# Altium schematic sheet VoltageRegulator1.SchDoc: VOLTAGE REGULATOR
size A4; DrawnBy: ROOPA GHATKE; SheetNumber: 1; SheetTotal: 1
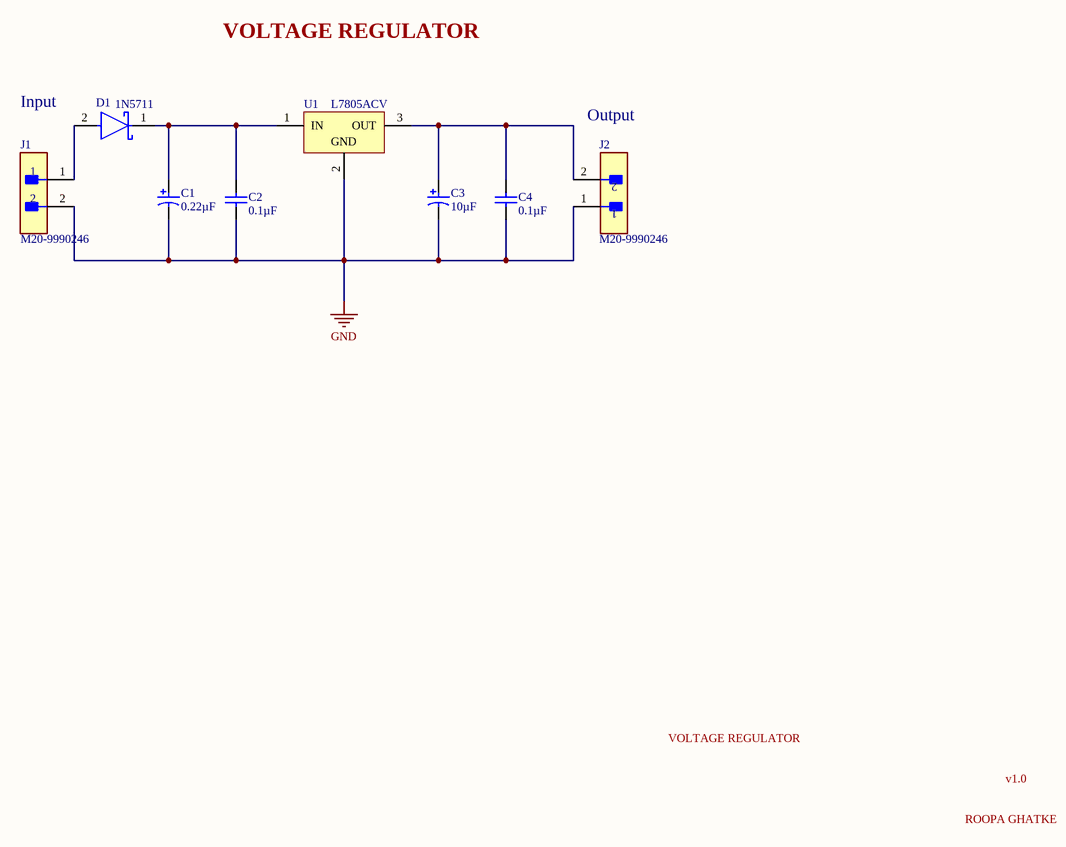
[diagram p0: VoltageRegulator1.SchDoc]

## Parts
C1  0.22µF  [CAPPR55-200-1100X500X1200]
C2  0.1µF  [CAPR51-254-508X318X736]
C3  10µF  [CAPPR55-200-1100X500X1200]
C4  0.1µF  [CAPR51-254-508X318X736]
D1  1N5711  [FP-DO-35-MFG]
J1  M20-9990246  [FP-M20-9990246-MFG]
J2  M20-9990246  [FP-M20-9990246-MFG]
U1  L7805ACV  [TO220]

## Nets
GND: C1.2 C2.2 C3.2 C4.1 J1.2 J2.1 U1.2(GND)
NetC1_1: C1.1 C2.1 D1.1(C) U1.1(IN)
NetC3_1: C3.1 C4.2 J2.2 U1.3(OUT)
NetD1_2: D1.2(A) J1.1

## Notes on the sheet
- VOLTAGE REGULATOR
- (near D1) Input
- Output
- v1.0
- ROOPA GHATKE

## Library data of the parts
C1 = CMP-1665-00040-2: Aluminum Electrolytic Capacitor, 2.2 uF, +/- 20%, 50 V, -40 to 85 degC, 2-Pin THD, RoHS, Bulk; Manufacturer: Panasonic; Voltage: 50V; Dielectric Material: Aluminium; Ripple Current: 20mA; Leakage Current: 3uA; Life (Hours): 2000Hour; Lead/Base Style: Straight; Dissipation Factor: 0.12%; Lead Diameter: 0.5mm; Capacitance: 2.2uF; Number of Pins: 2; Manufacturer URL: http://www.panasonic.com/; Contact Plating: Tin; Datasheet Version: Rev. 05, 10/2016; RoHSCompliant: true; Height - Seated (Max): 0.472inch; Height: 11mm; Length: 11mm; Termination: Radial; Packaging: Bulk; Case/Package: Radial; Voltage Rating (DC): 50V; Package Quantity: 200; Datasheet URL: https://industrial.panasonic.com/cdbs/www-data/pdf/RDF0000/ABA0000C1218.pdf; Radiation Hardening: No; REACH SVHC: NoSVHC; Max Operating Temperature: 85degC; Voltage Rating: 50V; Mount: ThroughHole; Diameter: 5mm; Lead Pitch: 2mm; Tolerance: 20%; Package Reference: CAPPR55-200-1100X500X1200; Lead Free: LeadFree; Package Description: 2-Pin Radial Lead, Dia 5 mm, Height 12 mm; Min Operating Temperature: -40degC
C2 C4 = CMP-1664-00004-1: Radial Leaded Multilayer Ceramic Capacitor, 0.1 uF, +/- 10%, 50 V, -55 to 125 degC, 2-Pin THD, RoHS, Tape and Reel; Case\Package: SOT-23-5; Max Power Dissipation: 250 mW; Output Current: 150 mA; Dropout Voltage: 260 mV; Outputs: 1; Output Voltage: 5 V; Max Input Voltage: 8 V; Min Operating Temperature: -40 degC; Packaging: Tape and Reel; Height: 1.3 mm; Radiation Hardening: No; Pins: 5; ComponentLink1Description: Manufacturer URL; Mount: Surface Mount; RoHSCompliant: true; Max Operating Temperature: 85 degC; PackageReference: CAPR51-254-508X318X736; ComponentLink2URL: http://www.kemet.com/docfinder?Partnumber=C320C104K5R5TA; PackageDescription: 2-Pin Through Hole Device, Body 5.08 x 3.18 mm, Pitch 2.54 mm; ComponentLink1URL: http://www.kemet.com/; Width: 1.8 mm; Package Quantity: 3000; DatasheetVersion: Dec-15; Length: 3 mm; ComponentLink2Description: Datasheet
C3 = CMP-1665-00036-2: Aluminum Electrolytic Capacitor, 22 uF, +/- 20%, 50 V, -40 to 85 degC, 2-Pin THD, RoHS, Bulk; Manufacturer: Panasonic; Ripple Current: 100mA; Life (Hours): 2000Hour; Voltage: 50V; Dissipation Factor: 0.12%; Leakage Current: 3uA; Lead/Base Style: Straight; Capacitance: 22uF; Lead Diameter: 0.5mm; Max Operating Temperature: 85degC; Height: 11mm; Package Reference: CAPPR55-200-1100X500X1200; Radiation Hardening: No; RoHSCompliant: true; Termination: Radial; Case/Package: Radial; REACH SVHC: NoSVHC; Height - Seated (Max): 0.472inch; Min Operating Temperature: -40degC; Packaging: Bulk; Manufacturer URL: http://www.panasonic.com/; Length: 11mm; Tolerance: 20%; Voltage Rating: 50V; Voltage Rating (DC): 50V; Datasheet URL: https://industrial.panasonic.com/cdbs/www-data/pdf/RDF0000/ABA0000C1218.pdf; Lead Pitch: 2mm; Ripple Current (AC): 100mA; Package Description: 2-Pin Radial Lead, Dia 5 mm, Height 12 mm; Diameter: 5mm; Datasheet Version: Rev. 05, 10/2016; Package Quantity: 200; Mount: ThroughHole
D1 = CMP-2000-05519-2: RF DIODE SCHOTTKY 70V 430MW DO35; Manufacturer: STMicroelectronics; Capacitance: 2pF; Max Junction Temp: +200°C; Value: 2pF; Forward Current: 15mA; ComponentLink2URL: https://www.st.com/resource/en/datasheet/1n5711.pdf; Reverse Voltage: 70V; Max Repetitive Reverse Voltage: 70V; Temperature Range Low: -65°C; Manufacturer Part Number: 1N5711; ComponentLink2Description: Datasheet; Automotive: No; Device Class L3: Schottky Diodes; Temperature Range High: +200°C; Ipc Land Pattern Name: DIOPA762W75L450D200; Octopart: https://octopart.com/1n5711-stmicroelectronics-55399277; Category: Diode; Height: 2mm; RoHS: TRUE; Package: DO-35; Lead Free: Yes; Digikey Description: RF DIODE SCHOTTKY 70V 430MW DO35; Mouser Description: Schottky Diodes & Rectifiers 15mA 70 Volt; Device Class L1: Discrete Semiconductors; Temperature: -65°C to +200°C; Device Class L2: Diodes
J1 J2 = CMP-15831-000009-1: CONN HEADER VERT 2POS 2.54MM; Manufacturer: Harwin; Conn Gender: Male; Conn Orientation: Vertical; Number Of Contacts: 2; Current Rating: 3A; ComponentLink2URL: https://cdn.harwin.com/pdfs/M20-999.pdf; ComponentLink2Description: Datasheet; Package: M20-9990246; Temperature: -40°C to +105°C; Octopart: https://octopart.com/m20-9990246-harwin-2590635; Mouser Description: 2.54mm (0.1") Pitch SIL Vertical PC Tail Pin Header, 6.1mm mating pin height, tin, 2 contacts; Temperature Range High: +105°C; Device Class L1: Connectors; RoHS: TRUE; Automotive: No; Height: 8.99mm; Number Of Rows: 1; Contact Material: Tin,Nickel; Category: Conn; Pitch: 2.54mm; Lead Free: Yes; Digikey Description: CONN HEADER VERT 2POS 2.54MM; Manufacturer Part Number: M20-9990246; Temperature Range Low: -40°C; Device Class L3: unset; Device Class L2: Headers and Wire Housings
U1 = CMP-0244-00484-1: Positive Voltage Regulator, 5V, 3-Pin TO-220; DatasheetVersion: 16/11/2011; ComponentLink2Description: Datasheet; ComponentLink3Description: Package Specification; ComponentLink2URL: http://www.st.com/internet/com/TECHNICAL_RESOURCES/TECHNICAL_LITERATURE/DATASHEET/CD00000444.pdf; PackageDescription: TO, Thru-Hole, Vertical, Heatsink Mounted; 3 In-Line Leads; Pitch 2.54 mm; ComponentLink3URL: http://www.st.com/internet/com/TECHNICAL_RESOURCES/TECHNICAL_LITERATURE/PACKAGE_INFORMATION/CD00004649.pdf; PackageReference: TO220; ComponentLink1URL: http://www.st.com; PackageVersion: ver3.0; ComponentLink1Description: Manufacturer URL